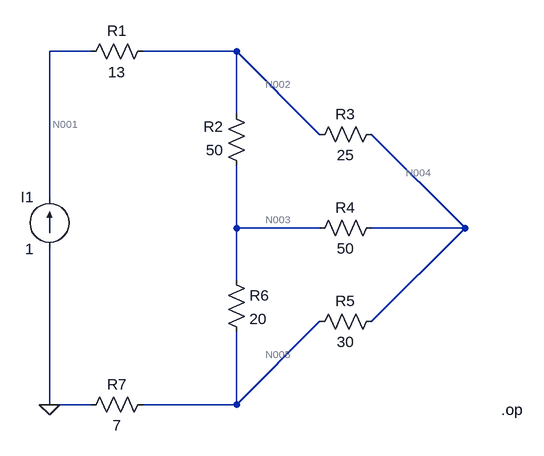
[diagram p0: schematic Lab07P01A.asc]
Lab07P01A.asc, the LTspice schematic file:
Version 4
SHEET 1 880 736
WIRE 48 96 -16 96
WIRE 272 96 128 96
WIRE 272 192 272 96
WIRE 400 224 272 96
WIRE -16 320 -16 96
WIRE 272 368 272 272
WIRE 400 368 272 368
WIRE 624 368 480 224
WIRE 624 368 480 368
WIRE 272 448 272 368
WIRE 480 512 624 368
WIRE -16 640 -16 400
WIRE 48 640 -16 640
WIRE 272 640 400 512
WIRE 272 640 272 528
WIRE 272 640 128 640
FLAG -16 640 0
DATAFLAG -16 96 ""
SYMBOL res 144 80 R90
WINDOW 0 0 56 VBottom 2
WINDOW 3 32 56 VTop 2
SYMATTR InstName R1
SYMATTR Value 13
SYMBOL res 288 288 R180
WINDOW 0 36 76 Left 2
WINDOW 3 36 40 Left 2
SYMATTR InstName R2
SYMATTR Value 50
SYMBOL res 496 208 R90
WINDOW 0 0 56 VBottom 2
WINDOW 3 32 56 VTop 2
SYMATTR InstName R3
SYMATTR Value 25
SYMBOL res 496 352 R90
WINDOW 0 0 56 VBottom 2
WINDOW 3 32 56 VTop 2
SYMATTR InstName R4
SYMATTR Value 50
SYMBOL res 496 496 R90
WINDOW 0 0 56 VBottom 2
WINDOW 3 32 56 VTop 2
SYMATTR InstName R5
SYMATTR Value 30
SYMBOL res 256 432 R0
SYMATTR InstName R6
SYMATTR Value 20
SYMBOL res 144 624 R90
WINDOW 0 0 56 VBottom 2
WINDOW 3 32 56 VTop 2
SYMATTR InstName R7
SYMATTR Value 7
SYMBOL current -16 400 R180
WINDOW 0 24 80 Left 2
WINDOW 3 24 0 Left 2
SYMATTR InstName I1
SYMATTR Value 1
TEXT 680 648 Left 2 !.op

The netlist it stands for:
* Lab07P01A.asc
R1 N002 N001 13
R2 N003 N002 50
R3 N004 N002 25
R4 N004 N003 50
R5 N004 N005 30
R6 N003 N005 20
R7 N005 0 7
I1 0 N001 1
.op
.backanno
.end

* Results of the author's LTspice run, read from the files saved beside the schematic
* Operating Point:
*   V(n002) = 37 V
*   V(n001) = 50 V
*   V(n003) = 17 V
*   V(n004) = 22 V
*   V(n005) = 7 V
*   I(I1) = 1 A
*   I(R1) = -1 A
*   I(R2) = -400 mA
*   I(R3) = -600 mA
*   I(R4) = 100 mA
*   I(R5) = 500 mA
*   I(R6) = 500 mA
*   I(R7) = 1 A